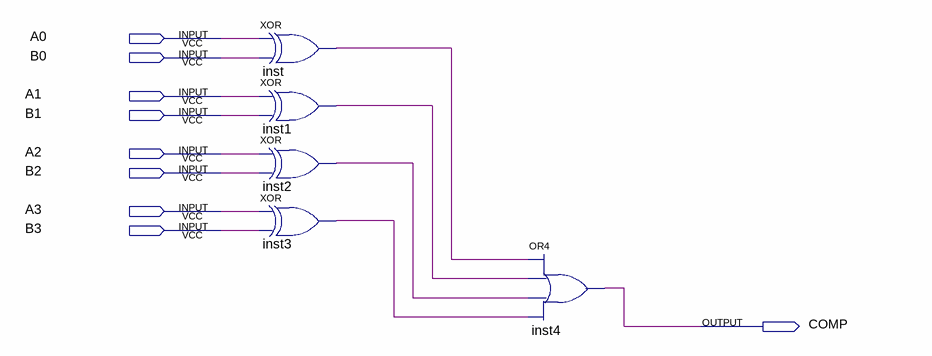
[diagram p0: schematic sheet]
// Quartus schematic Compare_4b.bdf as structural Verilog: 5 symbols, 9 pins
module Compare_4b (
  input  A0,
  input  B0,
  input  A1,
  input  B1,
  input  A2,
  input  B2,
  input  A3,
  input  B3,
  output COMP
);

  wire inst1_out, inst2_out, inst3_out, inst_out;

  xor inst (inst_out, A0, B0);
  xor inst1 (inst1_out, A1, B1);
  xor inst2 (inst2_out, A2, B2);
  xor inst3 (inst3_out, A3, B3);
  or inst4 (COMP, inst_out, inst1_out, inst2_out, inst3_out);
endmodule
